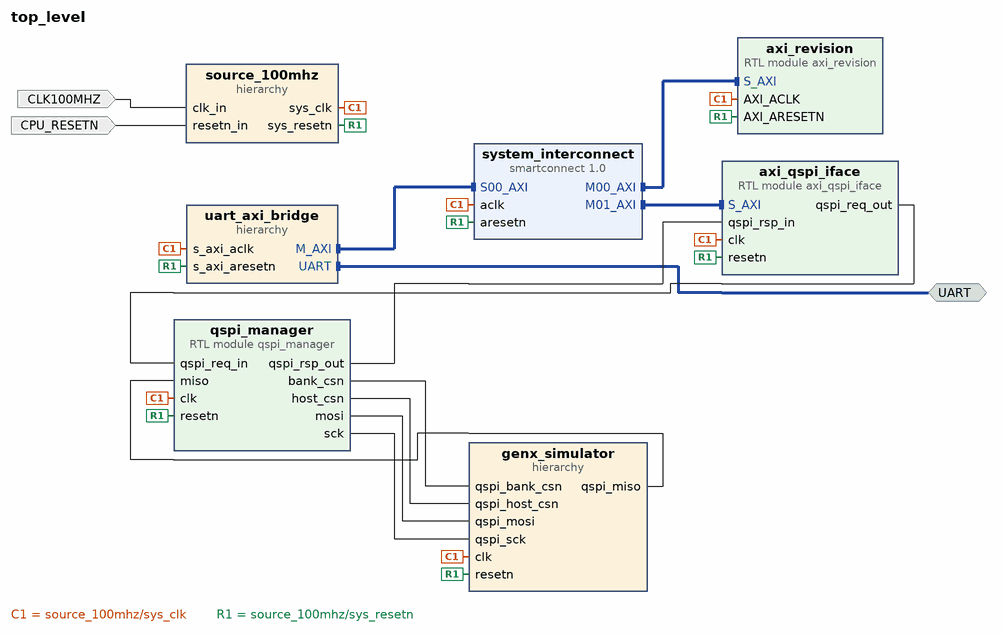
[diagram p0: block diagram of the top level]
# Vivado block design top_level, xc7a100tcsg324-1, Vivado 2021.1
create_bd_design top_level

create_bd_intf_port -mode Master -vlnv xilinx.com:interface:uart_rtl:1.0 UART
create_bd_port -dir I -type clk CLK100MHZ
create_bd_port -dir I -type rst CPU_RESETN

create_bd_cell -type hier source_100mhz
create_bd_cell -type hier uart_axi_bridge
create_bd_cell -type ip -vlnv xilinx.com:ip:smartconnect:1.0 system_interconnect
set_property -dict {CONFIG.NUM_MI 2 CONFIG.NUM_SI 1} [get_bd_cells system_interconnect]
create_bd_cell -type module -reference axi_revision axi_revision
create_bd_cell -type module -reference axi_qspi_iface axi_qspi_iface
create_bd_cell -type hier genx_simulator
create_bd_cell -type module -reference qspi_manager qspi_manager

# ---- hierarchy /source_100mhz ----
current_bd_instance /source_100mhz
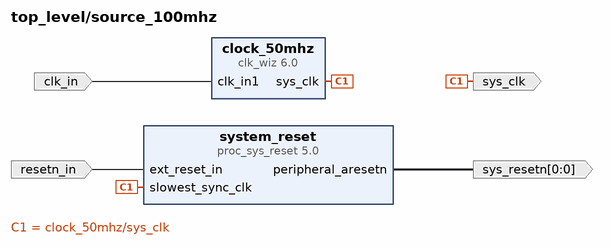
[diagram p1: block diagram inside /source_100mhz]
create_bd_pin -dir I -type clk clk_in
create_bd_pin -dir I -type rst resetn_in
create_bd_pin -dir O -type clk sys_clk
create_bd_pin -dir O -from 0 -to 0 sys_resetn

create_bd_cell -type ip -vlnv xilinx.com:ip:clk_wiz:6.0 clock_50mhz
set_property -dict [list \
  CONFIG.CLKOUT1_JITTER 151.636 \
  CONFIG.CLKOUT1_REQUESTED_OUT_FREQ 50 \
  CONFIG.CLK_OUT1_PORT sys_clk \
  CONFIG.MMCM_CLKOUT0_DIVIDE_F 20.000 \
  CONFIG.USE_LOCKED false \
  CONFIG.USE_RESET false \
] [get_bd_cells clock_50mhz]
create_bd_cell -type ip -vlnv xilinx.com:ip:proc_sys_reset:5.0 system_reset

# ---- hierarchy /uart_axi_bridge ----
current_bd_instance /uart_axi_bridge
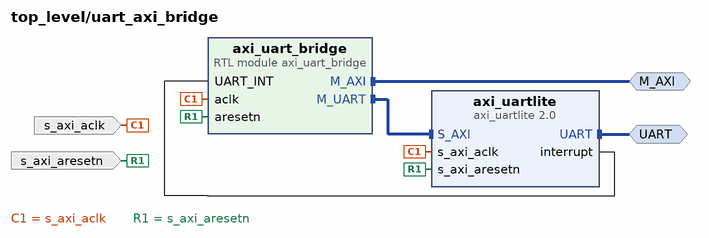
[diagram p2: block diagram inside /uart_axi_bridge]
create_bd_intf_pin -mode Master -vlnv xilinx.com:interface:uart_rtl:1.0 UART
create_bd_intf_pin -mode Master -vlnv xilinx.com:interface:aximm_rtl:1.0 M_AXI
create_bd_pin -dir I -type clk s_axi_aclk
create_bd_pin -dir I -type rst s_axi_aresetn

create_bd_cell -type module -reference axi_uart_bridge axi_uart_bridge
create_bd_cell -type ip -vlnv xilinx.com:ip:axi_uartlite:2.0 axi_uartlite
set_property -dict {CONFIG.C_BAUDRATE 115200} [get_bd_cells axi_uartlite]

# ---- hierarchy /genx_simulator ----
current_bd_instance /genx_simulator
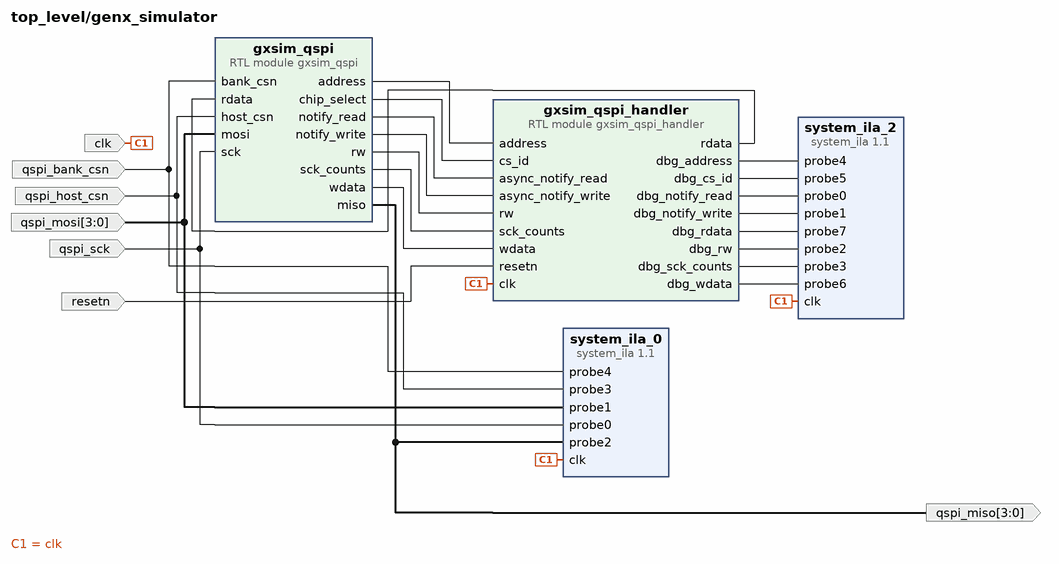
[diagram p3: block diagram inside /genx_simulator]
create_bd_pin -dir I -type clk clk
create_bd_pin -dir I -type rst resetn
create_bd_pin -dir I qspi_sck
create_bd_pin -dir I -from 3 -to 0 qspi_mosi
create_bd_pin -dir O -from 3 -to 0 qspi_miso
create_bd_pin -dir I qspi_host_csn
create_bd_pin -dir I qspi_bank_csn

create_bd_cell -type ip -vlnv xilinx.com:ip:system_ila:1.1 system_ila_0
set_property -dict {CONFIG.C_MON_TYPE NATIVE CONFIG.C_NUM_OF_PROBES 5} [get_bd_cells system_ila_0]
create_bd_cell -type ip -vlnv xilinx.com:ip:system_ila:1.1 system_ila_2
set_property -dict [list \
  CONFIG.C_MON_TYPE NATIVE \
  CONFIG.C_NUM_OF_PROBES 8 \
  CONFIG.C_PROBE_WIDTH_PROPAGATION AUTO \
] [get_bd_cells system_ila_2]
create_bd_cell -type module -reference gxsim_qspi gxsim_qspi
create_bd_cell -type module -reference gxsim_qspi_handler gxsim_qspi_handler

# ---- connections ----

current_bd_instance /source_100mhz
connect_bd_net -net clk_in1_0_1 [get_bd_pins clk_in] [get_bd_pins clock_50mhz/clk_in1]
connect_bd_net -net ext_reset_in_0_1 [get_bd_pins resetn_in] [get_bd_pins system_reset/ext_reset_in]
connect_bd_net -net system_clock_clk_100mhz [get_bd_pins clock_50mhz/sys_clk] [get_bd_pins sys_clk] [get_bd_pins system_reset/slowest_sync_clk]
connect_bd_net [get_bd_pins system_reset/peripheral_aresetn] [get_bd_pins sys_resetn]

current_bd_instance /uart_axi_bridge
connect_bd_intf_net [get_bd_intf_pins M_AXI] [get_bd_intf_pins axi_uart_bridge/M_AXI]
connect_bd_intf_net [get_bd_intf_pins axi_uart_bridge/M_UART] [get_bd_intf_pins axi_uartlite/S_AXI]
connect_bd_intf_net [get_bd_intf_pins UART] [get_bd_intf_pins axi_uartlite/UART]
connect_bd_net [get_bd_pins axi_uartlite/interrupt] [get_bd_pins axi_uart_bridge/UART_INT]
connect_bd_net -net source_100mhz_sys_clk [get_bd_pins s_axi_aclk] [get_bd_pins axi_uartlite/s_axi_aclk] [get_bd_pins axi_uart_bridge/aclk]
connect_bd_net -net source_100mhz_sys_resetn [get_bd_pins s_axi_aresetn] \
  [get_bd_pins axi_uartlite/s_axi_aresetn] [get_bd_pins axi_uart_bridge/aresetn]

current_bd_instance /genx_simulator
connect_bd_net -net genx_qspi_sim_miso [get_bd_pins gxsim_qspi/miso] [get_bd_pins qspi_miso] [get_bd_pins system_ila_0/probe2]
connect_bd_net [get_bd_pins gxsim_qspi/address] [get_bd_pins gxsim_qspi_handler/address]
connect_bd_net [get_bd_pins gxsim_qspi/chip_select] [get_bd_pins gxsim_qspi_handler/cs_id]
connect_bd_net -net gxsim_qspi_handler_0_rdata [get_bd_pins gxsim_qspi_handler/rdata] [get_bd_pins gxsim_qspi/rdata]
connect_bd_net [get_bd_pins gxsim_qspi_handler/dbg_address] [get_bd_pins system_ila_2/probe4]
connect_bd_net [get_bd_pins gxsim_qspi_handler/dbg_cs_id] [get_bd_pins system_ila_2/probe5]
connect_bd_net [get_bd_pins gxsim_qspi_handler/dbg_notify_read] [get_bd_pins system_ila_2/probe0]
connect_bd_net [get_bd_pins gxsim_qspi_handler/dbg_notify_write] [get_bd_pins system_ila_2/probe1]
connect_bd_net [get_bd_pins gxsim_qspi_handler/dbg_rdata] [get_bd_pins system_ila_2/probe7]
connect_bd_net [get_bd_pins gxsim_qspi_handler/dbg_rw] [get_bd_pins system_ila_2/probe2]
connect_bd_net [get_bd_pins gxsim_qspi_handler/dbg_sck_counts] [get_bd_pins system_ila_2/probe3]
connect_bd_net [get_bd_pins gxsim_qspi_handler/dbg_wdata] [get_bd_pins system_ila_2/probe6]
connect_bd_net [get_bd_pins gxsim_qspi/notify_read] [get_bd_pins gxsim_qspi_handler/async_notify_read]
connect_bd_net [get_bd_pins gxsim_qspi/notify_write] [get_bd_pins gxsim_qspi_handler/async_notify_write]
connect_bd_net [get_bd_pins gxsim_qspi/rw] [get_bd_pins gxsim_qspi_handler/rw]
connect_bd_net [get_bd_pins gxsim_qspi/sck_counts] [get_bd_pins gxsim_qspi_handler/sck_counts]
connect_bd_net [get_bd_pins gxsim_qspi/wdata] [get_bd_pins gxsim_qspi_handler/wdata]
connect_bd_net -net qspi_manager_bank_csn [get_bd_pins qspi_bank_csn] [get_bd_pins system_ila_0/probe4] [get_bd_pins gxsim_qspi/bank_csn]
connect_bd_net -net qspi_manager_host_csn [get_bd_pins qspi_host_csn] [get_bd_pins system_ila_0/probe3] [get_bd_pins gxsim_qspi/host_csn]
connect_bd_net -net qspi_manager_mosi [get_bd_pins qspi_mosi] [get_bd_pins system_ila_0/probe1] [get_bd_pins gxsim_qspi/mosi]
connect_bd_net -net qspi_manager_sck [get_bd_pins qspi_sck] [get_bd_pins system_ila_0/probe0] [get_bd_pins gxsim_qspi/sck]
connect_bd_net -net source_100mhz_sys_clk [get_bd_pins clk] \
  [get_bd_pins system_ila_0/clk] [get_bd_pins system_ila_2/clk] [get_bd_pins gxsim_qspi_handler/clk]
connect_bd_net -net source_100mhz_sys_resetn [get_bd_pins resetn] [get_bd_pins gxsim_qspi_handler/resetn]

current_bd_instance /
connect_bd_intf_net -intf_net axi_uartlite_UART [get_bd_intf_ports UART] [get_bd_intf_pins uart_axi_bridge/UART]
connect_bd_intf_net [get_bd_intf_pins system_interconnect/M00_AXI] [get_bd_intf_pins axi_revision/S_AXI]
connect_bd_intf_net [get_bd_intf_pins axi_qspi_iface/S_AXI] [get_bd_intf_pins system_interconnect/M01_AXI]
connect_bd_intf_net [get_bd_intf_pins uart_axi_bridge/M_AXI] [get_bd_intf_pins system_interconnect/S00_AXI]
connect_bd_net -net axi_qspi_iface_0_qspi_req_out [get_bd_pins axi_qspi_iface/qspi_req_out] [get_bd_pins qspi_manager/qspi_req_in]
connect_bd_net -net clk_in1_0_1 [get_bd_ports CLK100MHZ] [get_bd_pins source_100mhz/clk_in]
connect_bd_net -net ext_reset_in_0_1 [get_bd_ports CPU_RESETN] [get_bd_pins source_100mhz/resetn_in]
connect_bd_net -net genx_qspi_sim_miso [get_bd_pins genx_simulator/qspi_miso] [get_bd_pins qspi_manager/miso]
connect_bd_net [get_bd_pins qspi_manager/bank_csn] [get_bd_pins genx_simulator/qspi_bank_csn]
connect_bd_net [get_bd_pins qspi_manager/host_csn] [get_bd_pins genx_simulator/qspi_host_csn]
connect_bd_net [get_bd_pins qspi_manager/mosi] [get_bd_pins genx_simulator/qspi_mosi]
connect_bd_net [get_bd_pins qspi_manager/qspi_rsp_out] [get_bd_pins axi_qspi_iface/qspi_rsp_in]
connect_bd_net [get_bd_pins qspi_manager/sck] [get_bd_pins genx_simulator/qspi_sck]
connect_bd_net [get_bd_pins source_100mhz/sys_clk] \
  [get_bd_pins uart_axi_bridge/s_axi_aclk] [get_bd_pins system_interconnect/aclk] [get_bd_pins axi_revision/AXI_ACLK] \
  [get_bd_pins axi_qspi_iface/clk] [get_bd_pins genx_simulator/clk] [get_bd_pins qspi_manager/clk]
connect_bd_net [get_bd_pins source_100mhz/sys_resetn] \
  [get_bd_pins uart_axi_bridge/s_axi_aresetn] [get_bd_pins system_interconnect/aresetn] \
  [get_bd_pins axi_revision/AXI_ARESETN] [get_bd_pins axi_qspi_iface/resetn] [get_bd_pins genx_simulator/resetn] \
  [get_bd_pins qspi_manager/resetn]

# ---- address map ----
assign_bd_address -offset 0x0000000000000000 -range 256 -target_address_space [get_bd_addr_spaces uart_axi_bridge/axi_uart_bridge/M_AXI] [get_bd_addr_segs axi_revision/S_AXI/reg0]
assign_bd_address -offset 0x0000000000001000 -range 256 -target_address_space [get_bd_addr_spaces uart_axi_bridge/axi_uart_bridge/M_AXI] [get_bd_addr_segs axi_qspi_iface/S_AXI/reg0]
assign_bd_address -offset 0x40600000 -range 64K -target_address_space [get_bd_addr_spaces uart_axi_bridge/axi_uart_bridge/M_UART] [get_bd_addr_segs uart_axi_bridge/axi_uartlite/S_AXI/Reg]

validate_bd_design
save_bd_design
